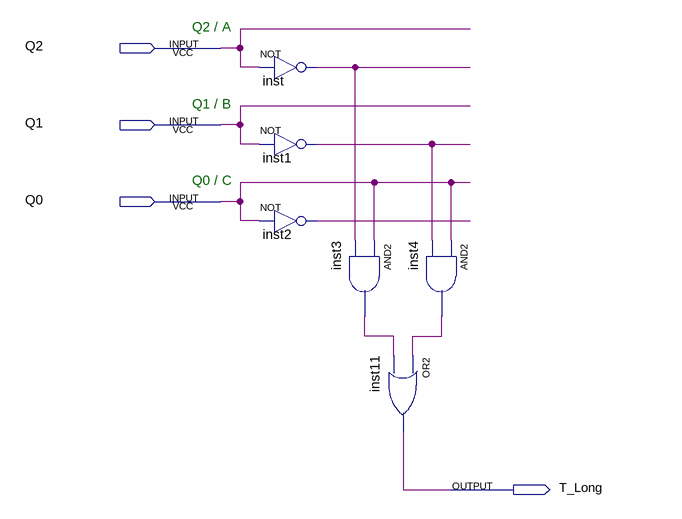
[diagram p0: schematic sheet]
// Quartus schematic Timer_Decoder.bdf as structural Verilog: 6 symbols, 4 pins
module Timer_Decoder (
  input  Q2,
  input  Q1,
  input  Q0,
  output T_Long
);

  wire inst1_out, inst2_out, inst3_out, inst4_out, inst_out;

  not inst (inst_out, Q2);
  not inst1 (inst1_out, Q1);
  not inst2 (inst2_out, Q0);
  and inst3 (inst3_out, Q0, inst_out);
  or inst11 (T_Long, inst4_out, inst3_out);
  and inst4 (inst4_out, Q0, inst1_out);

  // Notes on the sheet:
  //   Q2 / A
  //   Q1 / B
  //   Q0 / C
endmodule
